# EAGLE design p1dc-001 (EAGLE 9.6.2)
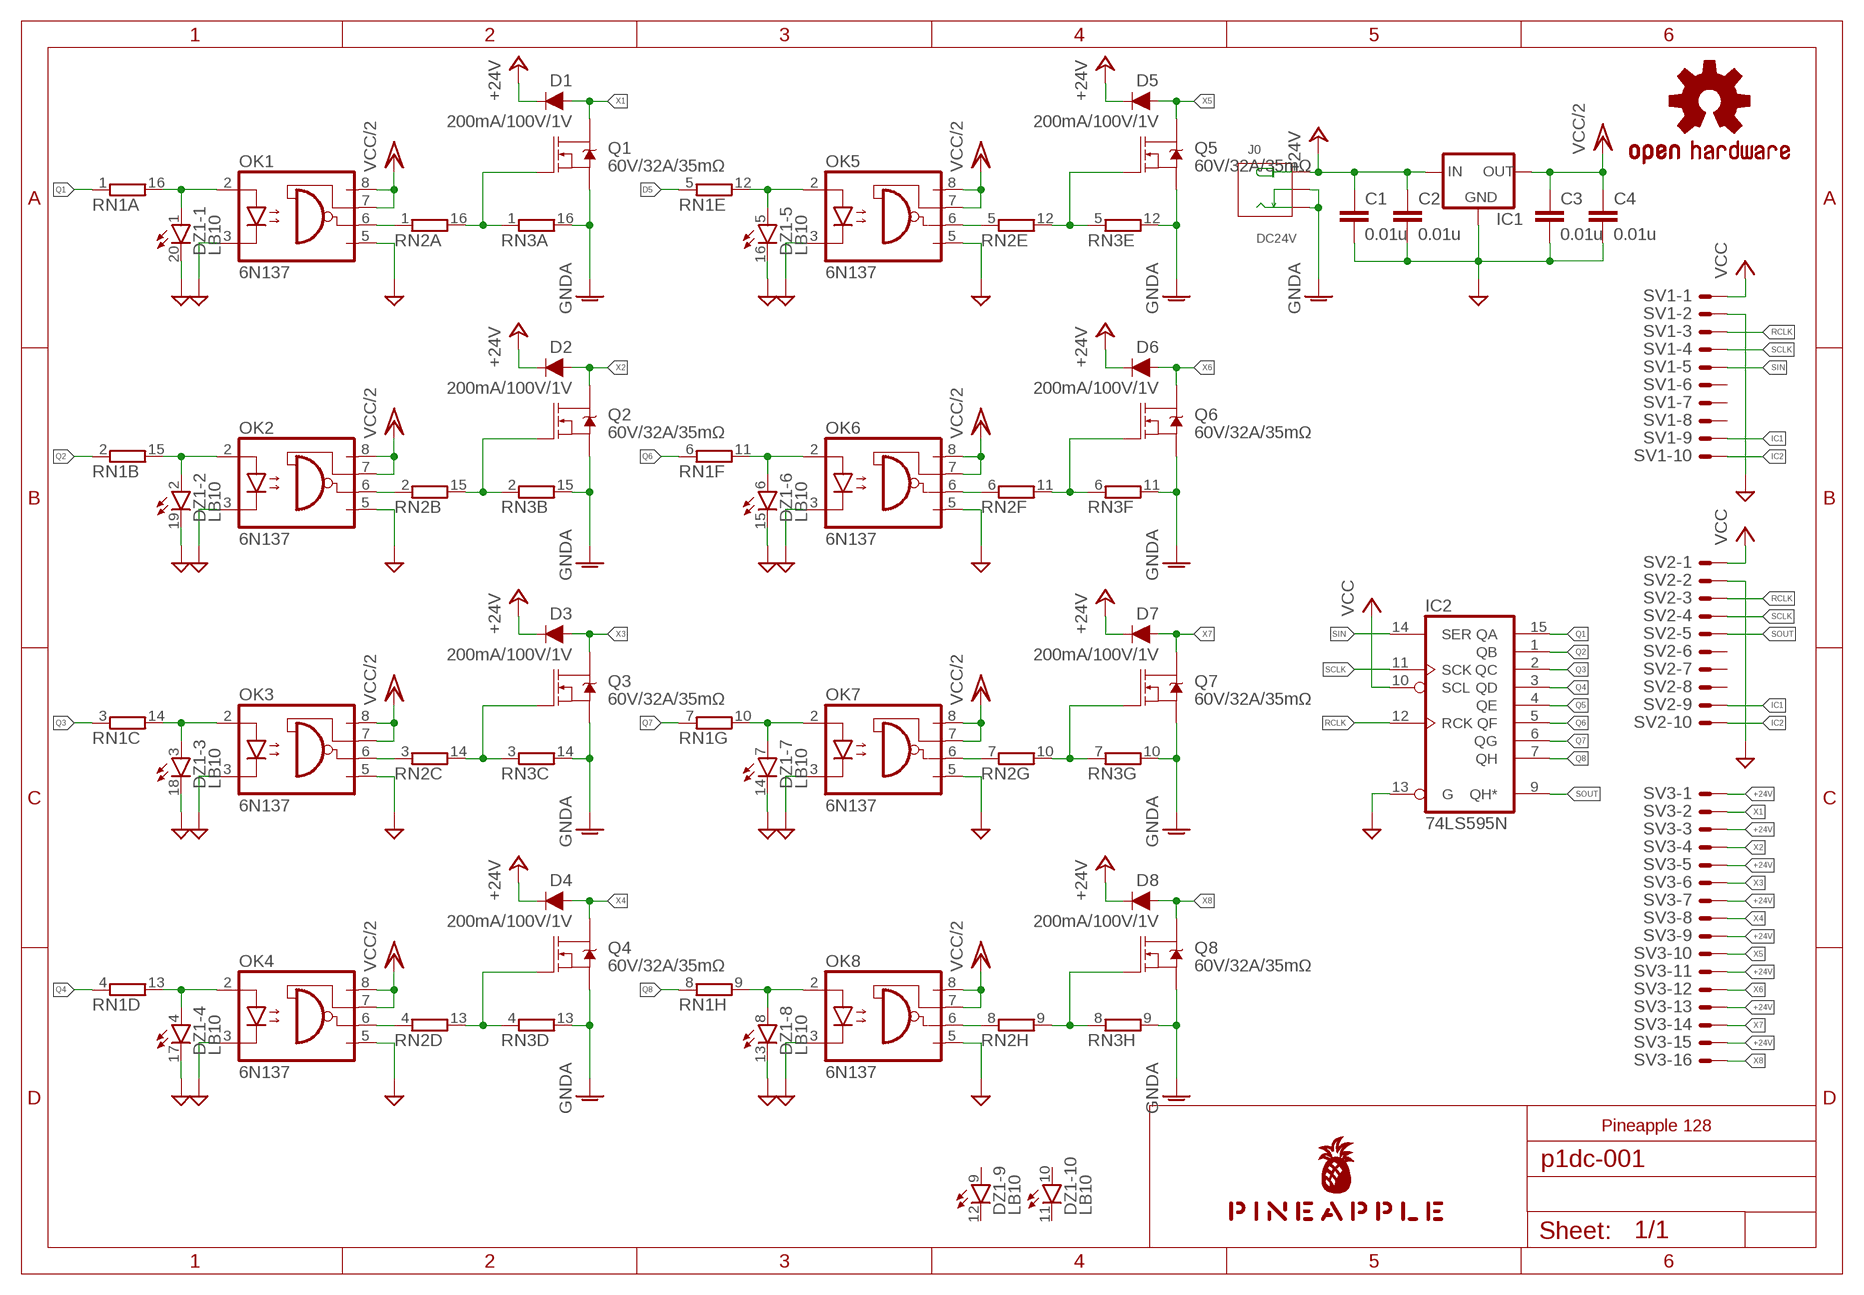
[diagram p0: schematic, sheet 1]

## Parts
C1  0.01u  C-EU025-024X044  [C025-024X044]
C2  0.01u  C-EU025-024X044  [C025-024X044]
C3  0.01u  C-EU025-024X044  [C025-024X044]
C4  0.01u  C-EU025-024X044  [C025-024X044]
D1  200mA/100V/1V  DIODE-1N4148  [DIODE-1N4148]
D2  200mA/100V/1V  DIODE-1N4148  [DIODE-1N4148]
D3  200mA/100V/1V  DIODE-1N4148  [DIODE-1N4148]
D4  200mA/100V/1V  DIODE-1N4148  [DIODE-1N4148]
D5  200mA/100V/1V  DIODE-1N4148  [DIODE-1N4148]
D6  200mA/100V/1V  DIODE-1N4148  [DIODE-1N4148]
D7  200mA/100V/1V  DIODE-1N4148  [DIODE-1N4148]
D8  200mA/100V/1V  DIODE-1N4148  [DIODE-1N4148]
DZ1  LB10  [LB10]
IC1  78XXS  [78XXS]
IC2  74LS595N  [DIL16]
J0  DC24V  JACK-DC-005'DC-005'  [3P-L14.2*W11.0*H9.0MM]
LOGO1  OSHW-LOGOS-COPPER  [OSHW-LOGO-S_COPPER]
OK1  6N137  [DIL08]
OK2  6N137  [DIL08]
OK3  6N137  [DIL08]
OK4  6N137  [DIL08]
OK5  6N137  [DIL08]
OK6  6N137  [DIL08]
OK7  6N137  [DIL08]
OK8  6N137  [DIL08]
Q1  60V/32A/35mΩ  MOSFET-NCH-FQP30N06L  [TO220V]
Q2  60V/32A/35mΩ  MOSFET-NCH-FQP30N06L  [TO220V]
Q3  60V/32A/35mΩ  MOSFET-NCH-FQP30N06L  [TO220V]
Q4  60V/32A/35mΩ  MOSFET-NCH-FQP30N06L  [TO220V]
Q5  60V/32A/35mΩ  MOSFET-NCH-FQP30N06L  [TO220V]
Q6  60V/32A/35mΩ  MOSFET-NCH-FQP30N06L  [TO220V]
Q7  60V/32A/35mΩ  MOSFET-NCH-FQP30N06L  [TO220V]
Q8  60V/32A/35mΩ  MOSFET-NCH-FQP30N06L  [TO220V]
RN1  8R-N  [DIL16]
RN2  8R-N  [DIL16]
RN3  8R-N  [DIL16]
SV1  ML10LE  [ML10L]
SV2  ML10LE  [ML10L]
SV3  ML16LE  [ML16L]
U$1  PINEAPPLE450_SILK  [PINEAPPLE450_SILK]

## Nets
+24V [power]: C1.1 C2.1 D1.C D2.C D3.C D4.C D5.C D6.C D7.C D8.C IC1.IN J0.+ SV3.1 SV3.3 SV3.5 SV3.7 SV3.9 SV3.11 SV3.13 SV3.15
D5: RN1.5
GND [gnd]: C1.2 C2.2 C3.2 C4.2 DZ1.13(-8:C) DZ1.14(-7:C) DZ1.15(-6:C) DZ1.16(-5:C) DZ1.17(-4:C) DZ1.18(-3:C) DZ1.19(-2:C) DZ1.20(-1:C) IC1.GND IC2.13(G) OK1.3(C) OK1.5(GND) OK2.3(C) OK2.5(GND) OK3.3(C) OK3.5(GND) OK4.3(C) OK4.5(GND) OK5.3(C) OK5.5(GND) OK6.3(C) OK6.5(GND) OK7.3(C) OK7.5(GND) OK8.3(C) OK8.5(GND) SV1.2 SV2.2
GNDA [gnd]: J0.-1(-) J0.-2(CDN) Q1.3(S) Q2.3(S) Q3.3(S) Q4.3(S) Q5.3(S) Q6.3(S) Q7.3(S) Q8.3(S) RN3.9 RN3.10 RN3.11 RN3.12 RN3.13 RN3.14 RN3.15 RN3.16
IC1: SV1.9 SV2.9
IC2: SV1.10 SV2.10
N$1: DZ1.1(-1:A) OK1.2(A) RN1.16
N$2: OK1.6(VO) RN2.1
N$3: Q1.1(G) RN2.16 RN3.1
N$4: DZ1.2(-2:A) OK2.2(A) RN1.15
N$5: OK2.6(VO) RN2.2
N$6: Q2.1(G) RN2.15 RN3.2
N$7: DZ1.3(-3:A) OK3.2(A) RN1.14
N$8: OK3.6(VO) RN2.3
N$9: Q3.1(G) RN2.14 RN3.3
N$10: DZ1.4(-4:A) OK4.2(A) RN1.13
N$11: OK4.6(VO) RN2.4
N$12: Q4.1(G) RN2.13 RN3.4
N$13: DZ1.5(-5:A) OK5.2(A) RN1.12
N$14: OK5.6(VO) RN2.5
N$15: Q5.1(G) RN2.12 RN3.5
N$16: DZ1.6(-6:A) OK6.2(A) RN1.11
N$17: OK6.6(VO) RN2.6
N$18: Q6.1(G) RN2.11 RN3.6
N$19: DZ1.7(-7:A) OK7.2(A) RN1.10
N$20: OK7.6(VO) RN2.7
N$21: Q7.1(G) RN2.10 RN3.7
N$22: DZ1.8(-8:A) OK8.2(A) RN1.9
N$23: OK8.6(VO) RN2.8
N$24: Q8.1(G) RN2.9 RN3.8
Q1: IC2.15(QA) RN1.1
Q2: IC2.1(QB) RN1.2
Q3: IC2.2(QC) RN1.3
Q4: IC2.3(QD) RN1.4
Q5: IC2.4(QE)
Q6: IC2.5(QF) RN1.6
Q7: IC2.6(QG) RN1.7
Q8: IC2.7(QH) RN1.8
RCLK: IC2.12(RCK) SV1.3 SV2.3
SCLK: IC2.11(SCK) SV1.4 SV2.4
SIN: IC2.14(SER) SV1.5
SOUT: IC2.9(QH*) SV2.5
VCC: IC2.10(SCL) SV1.1 SV2.1
VCC/2 [power]: C3.1 C4.1 IC1.OUT OK1.7(VE) OK1.8(VCC) OK2.7(VE) OK2.8(VCC) OK3.7(VE) OK3.8(VCC) OK4.7(VE) OK4.8(VCC) OK5.7(VE) OK5.8(VCC) OK6.7(VE) OK6.8(VCC) OK7.7(VE) OK7.8(VCC) OK8.7(VE) OK8.8(VCC)
X1: D1.A Q1.2(D) SV3.2
X2: D2.A Q2.2(D) SV3.4
X3: D3.A Q3.2(D) SV3.6
X4: D4.A Q4.2(D) SV3.8
X5: D5.A Q5.2(D) SV3.10
X6: D6.A Q6.2(D) SV3.12
X7: D7.A Q7.2(D) SV3.14
X8: D8.A Q8.2(D) SV3.16
Unconnected: DZ1.9(-9:A) DZ1.10(-10:A) DZ1.11(-10:C) DZ1.12(-9:C) SV1.6 SV1.7 SV1.8 SV2.6 SV2.7 SV2.8

## Notes on the sheet
- Pineapple 128

## Power pins joined to a net without a drawn wire
GND: IC2.8(GND)
VCC: IC2.16(VCC)

## Library data of the parts
C1-C4 = resistor:C-EU: CAPACITOR, European symbol
D1-D8 = SparkFun-DiscreteSemi:DIODE: Diode These are standard reverse protection diodes and small signal diodes. SparkFun Products: SparkFun SparkPunk Sound Kit <https://www.sparkfun.com/products/11177> SparkFun ESP8266 Thing <https://www.sparkfun.com/products/13231>; PROD_ID: DIO-08378
DZ1 = led:LB10: LED BLOCK 10-LED bar graph, DIL, Siemens
IC1 = v-reg:78XXS: VOLTAGE REGULATOR
IC2 = 74xx-us:74*595: 8-bit SHIFT REGISTER, output latch
J0 = Seeed-Connector:JACK-DC-005: 320120003
LOGO1 = SparkFun-Aesthetics:OSHW-LOGO: Open-Source Hardware (OSHW) Logo This logo indicates the piece of hardware it is found on incorporates a OSHW license and/or adheres to the definition of open source hardware found here: http://freedomdefined.org/OSHW
OK1-OK8 = optocoupler:6N137: MOTOROLA OPTO COUPLER; MPN: 6N137; OC_FARNELL: 1328376; OC_NEWARK: 52M1895
Q1-Q8 = SparkFun-DiscreteSemi:MOSFET-NCH: N-channel MOSFETs Voltage controlled devices that allow control of high current outputs. SparkFun Products: SparkFun OpenScale <https://www.sparkfun.com/products/13261> SparkFun Digital Sandbox <https://www.sparkfun.com/products/12651> SparkFun Monster Moto Shield <https://www.sparkfun.com/products/10182> SparkFun MOSFET Power Controller <https://www.sparkfun.com/products/11214>; PROD_ID: TRANS-10060
RN1-RN3 = resistor-dil:8R-N: DIL RESISTOR; OC_FARNELL: unknown; OC_NEWARK: unknown
SV1 SV2 = con-ml:ML10LE: HARTING; OC_FARNELL: unknown; OC_NEWARK: unknown
SV3 = con-ml:ML16LE: HARTING; OC_FARNELL: unknown; OC_NEWARK: unknown
U$1 = pineapple:PINEAPPLE450_SILK

## Net classes
0 default: width 0.152 mm, drill 0.152 mm, clearance 0.152 mm
1 gnd: width 0.61 mm, drill 0.152 mm, clearance 0.152 mm
2 power: width 0.61 mm, drill 0.152 mm, clearance 0.152 mm
3 analog: width 0.152 mm, drill 0.152 mm, clearance 0.152 mm

## Board
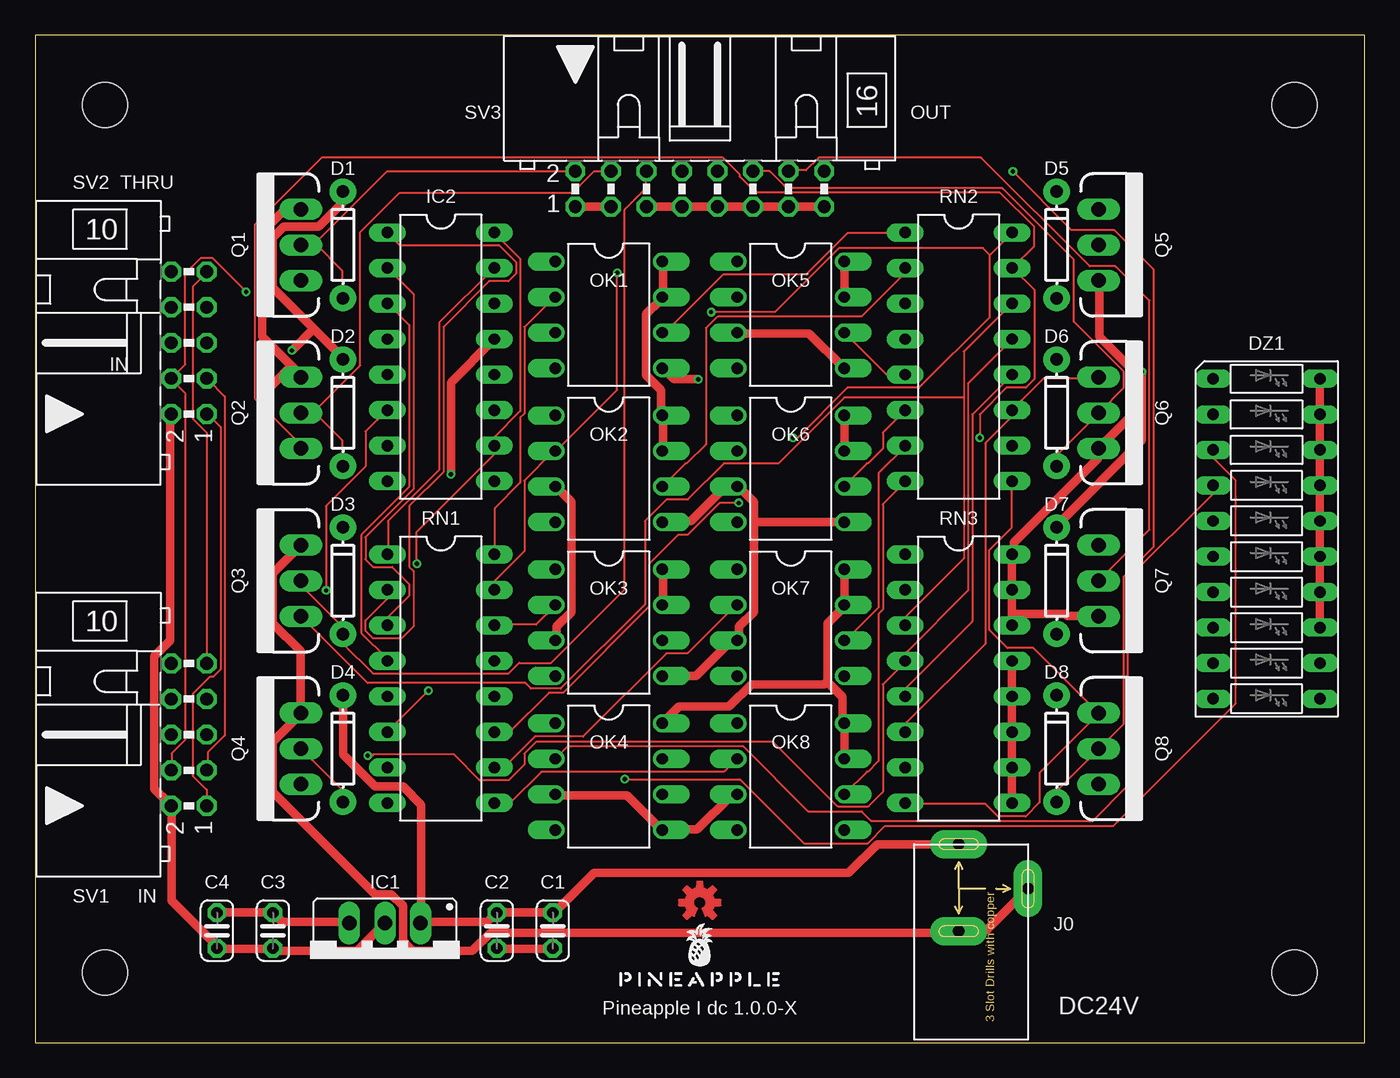
[diagram p1: board, top side]
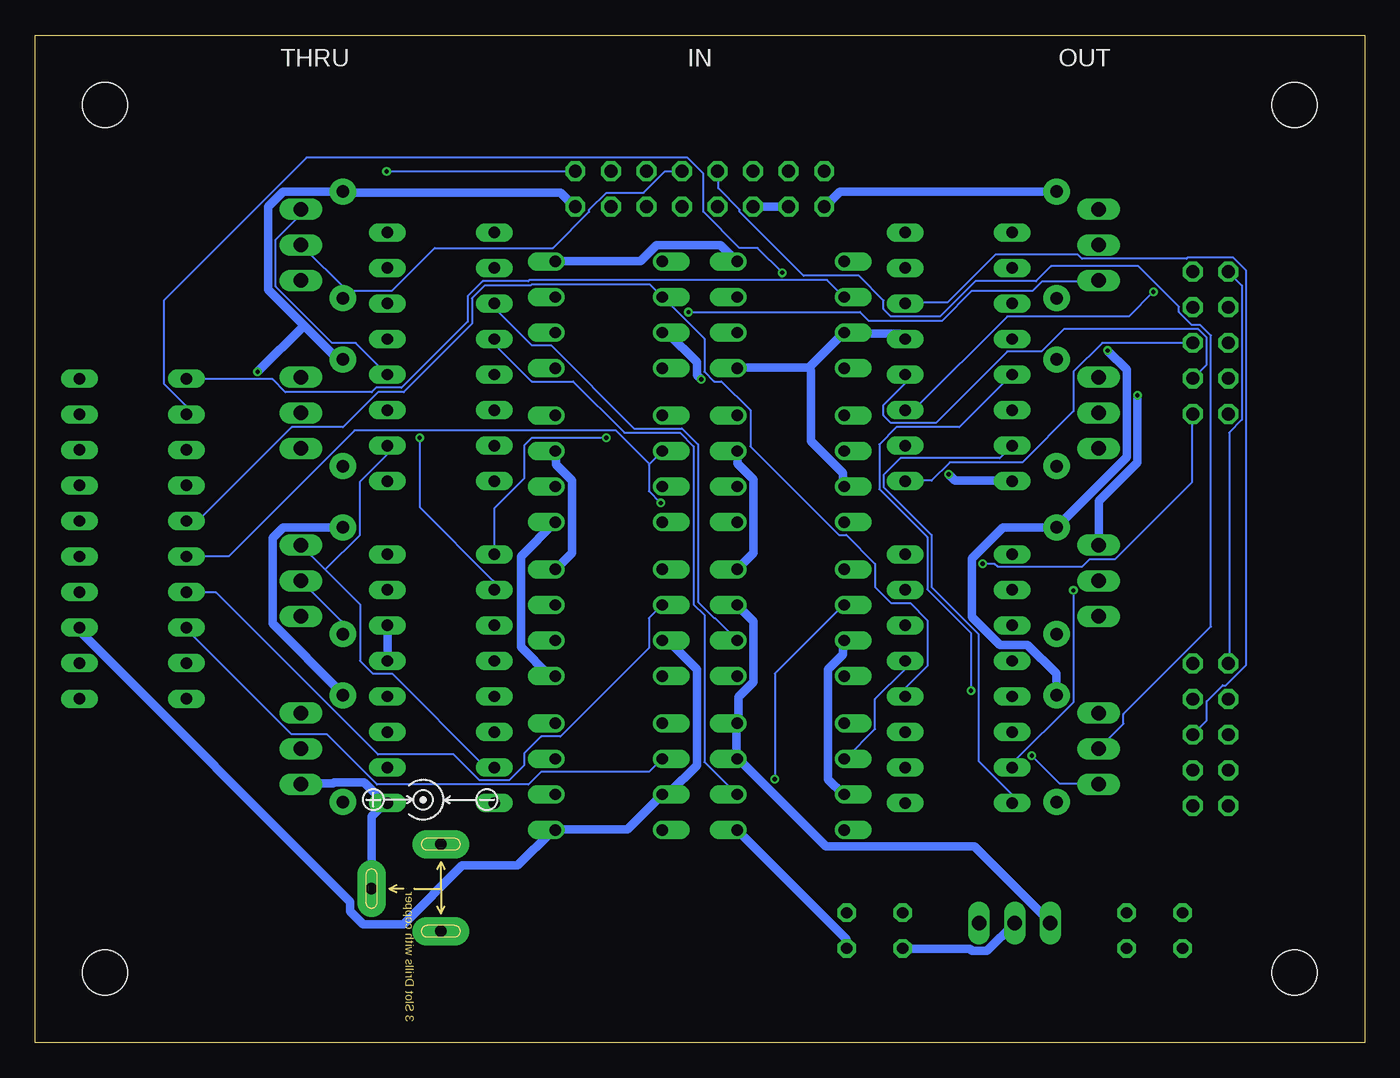
[diagram p2: board, bottom side, seen from below]

Size 95 x 72 mm. Coordinates in mm from the lower left corner, seen from the top.
Outline: 0,0 95,0 95,72 0,72 0,0
Copper layers (1*16): Top 0.035mm / dielectric 1.5mm / Bottom 0.035mm
Design rules "SeeedStudio_2layer_DRU_no_angle_20140221": minimum track width 6mil, minimum drill 12mil, track to track 6mil, track to pad 6mil, pad to pad 6mil, via to via 6mil, smd to smd 0mil, copper to edge 10mil, drill to drill 10mil, minimum pad ring 10mil, minimum via ring 6mil, stop-mask expansion 2mil, vias tented up to drill 100mil, thermal gap 10mil
Holes 3.2 mm at 5,5 90,5 90,67 5,67
tRestrict: area 2.8,64.8 to 7.2,69.2; area 87.8,64.8 to 92.2,69.2; area 2.8,2.8 to 7.2,7.2; area 87.8,2.8 to 92.2,7.2; area 0,71 to 95,72; area 94,0 to 95,72; area 0,0 to 95,1; area 0,0 to 1,72
bRestrict: area 2.8,2.8 to 7.2,7.2; area 87.8,2.8 to 92.2,7.2; area 87.8,64.8 to 92.2,69.2; area 2.8,64.8 to 7.2,69.2; area 0,71 to 95,72; area 94,0 to 95,72; area 0,0 to 95,1; area 0,0 to 1,72

### Footprints (pad centres in the part's own frame; a part is rotated, then mirrored left to right if it is on the bottom)
C025-024X044 = drill 0.813 octagon: 1 -1.27,0; 2 1.27,0
DIODE-1N4148 = drill 0.9 pad 1.88: A -3.81,0; C 3.81,0
LB10 = drill 0.813 long: 1 -11.43,-3.81; 2 -8.89,-3.81; 3 -6.35,-3.81; 4 -3.81,-3.81; 5 -1.27,-3.81; 6 1.27,-3.81; 7 3.81,-3.81; 8 6.35,-3.81; 9 8.89,-3.81; 10 11.43,-3.81; 11 11.43,3.81; 12 8.89,3.81; 13 6.35,3.81; 14 3.81,3.81; 15 1.27,3.81; 16 -1.27,3.81; 17 -3.81,3.81; 18 -6.35,3.81; 19 -8.89,3.81; 20 -11.43,3.81
78XXS = drill 1.016 long: GND 0,-2.54; IN -2.54,-2.54; OUT 2.54,-2.54
DIL16 = drill 0.813 long: 1 -8.89,-3.81; 2 -6.35,-3.81; 3 -3.81,-3.81; 4 -1.27,-3.81; 5 1.27,-3.81; 6 3.81,-3.81; 7 6.35,-3.81; 8 8.89,-3.81; 9 8.89,3.81; 10 6.35,3.81; 11 3.81,3.81; 12 1.27,3.81; 13 -1.27,3.81; 14 -3.81,3.81; 15 -6.35,3.81; 16 -8.89,3.81
3P-L14.2*W11.0*H9.0MM = drill 0.813 pad 2.032 long: + 3.175,0; -1 -3.048,0; -2 0,-4.953
DIL08 = drill 0.813 offset: 1 -3.81,-3.81; 2 -1.27,-3.81; 3 1.27,-3.81; 4 3.81,-3.81; 5 3.81,3.81; 6 1.27,3.81; 7 -1.27,3.81; 8 -3.81,3.81
TO220V = drill 1.016 long: 1 -2.54,0; 2 0,0; 3 2.54,0
ML10L = drill 0.914 octagon: 1 -5.08,-1.27; 2 -5.08,1.27; 3 -2.54,-1.27; 4 -2.54,1.27; 5 0,-1.27; 6 0,1.27; 7 2.54,-1.27; 8 2.54,1.27; 9 5.08,-1.27; 10 5.08,1.27
ML16L = drill 0.914 octagon: 1 -8.89,-1.27; 2 -8.89,1.27; 3 -6.35,-1.27; 4 -6.35,1.27; 5 -3.81,-1.27; 6 -3.81,1.27; 7 -1.27,-1.27; 8 -1.27,1.27; 9 1.27,-1.27; 10 1.27,1.27; 11 3.81,-1.27; 12 3.81,1.27; 13 6.35,-1.27; 14 6.35,1.27; 15 8.89,-1.27; 16 8.89,1.27

### Placement (x,y rotation side)
C1  37,8 270 top
C2  33,8 270 top
C3  17,8 270 top
C4  13,8 270 top
D1  22,57 90 top
D2  22,45 90 top
D3  22,33 90 top
D4  22,21 90 top
D5  73,57 90 top
D6  73,45 90 top
D7  73,33 90 top
D8  73,21 90 top
DZ1  88,36 270 top
IC1  25,6 180 top
IC2  29,49 270 top
J0  66,11 90 top
LOGO1  47.5,10 0 top
OK1  41,52 270 top
OK2  41,41 270 top
OK3  41,30 270 top
OK4  41,19 270 top
OK5  54,52 270 top
OK6  54,41 270 top
OK7  54,30 270 top
OK8  54,19 270 top
Q1  19,57 90 top
Q2  19,45 90 top
Q3  19,33 90 top
Q4  19,21 90 top
Q5  76,57 270 top
Q6  76,45 270 top
Q7  76,33 270 top
Q8  76,21 270 top
RN1  29,26 270 top
RN2  66,49 270 top
RN3  66,26 270 top
SV1  11,22 90 top
SV2  11,50 90 top
SV3  47.5,61 0 top
U$1  47.5,4 0 top

### Tracks (layer width: path | path; a pad name or v marks a point on that pad's centre or on a via)
+24V  (via drill 0.3)
  Top 0.61: D4.C 22.02,24.77 22.02,20.57 24.31,18.29 26.29,18.29 27.58,16.99 27.58,8.91 IC1.IN 27.58,8.61 32.31,8.61 32.77,9.07 C2.1 33.07,9.3 36.96,9.3 C1.1 37.26,9.45 39.93,12.12 58.14,12.12 60.2,14.17 J0.+ | v79.1,47.93 79.1,43.05 73.08,37.03 73.08,36.88 D7.C | 19.93,51.02 16.99,53.95 16.99,57.53 17.75,58.29 20.27,58.29 21.95,59.97 21.95,60.81 D1.C | 19.93,51.02 21.95,49 21.95,48.84 D2.C | SV3.1 38.63,59.74 SV3.3 | SV3.5 43.74,59.74 46.18,59.74 SV3.7 46.48,59.74 SV3.9 49.07,59.74 51.28,59.74 SV3.11 51.59,59.74 53.8,59.74 SV3.13 54.1,59.74 SV3.15 | 19.93,51.02 v18.36,49.45
  Bottom 0.61: D4.C 22.02,24.84 22.02,26.36 24.08,28.42 26.06,28.42 28.04,30.4 28.04,34.59 25.83,36.8 22.02,36.8 D3.C 21.79,37.03 16.99,41.83 16.99,48.08 v18.36,49.45 | D8.C 73.08,24.84 73.08,24.99 78.03,29.95 78.03,36.04 77.27,36.8 73.08,36.8 D7.C | 75.78,51.24 78.33,53.8 78.33,59.74 77.27,60.81 73.08,60.81 D5.C 72.69,60.73 57.45,60.73 56.46,59.74 SV3.15 | 75.78,51.24 73.38,48.84 73.08,48.84 D6.C | 75.78,51.24 v79.1,47.93 | SV3.3 41.22,59.74 43.66,59.74 SV3.5 | D1.C 22.02,60.81 37.49,60.81 38.56,59.74 SV3.1
GND  (via drill 0.3)
  Top 0.61: C2.2 33.07,6.71 36.96,6.71 C1.2 | SV2.2 9.68,44.88 9.68,28.73 8.53,27.58 8.53,18.14 9.53,17.14 SV1.2 9.75,16.92 9.75,10.13 12.88,7.01 C4.2 13.03,6.71 16.99,6.71 C3.2 17.22,6.55 23.01,6.55 IC1.GND | OK3.3 37.26,28.8 37.26,29.72 38.33,30.79 38.33,38.63 37.26,39.7 OK2.3 | OK5.3 50.22,50.67 55.32,50.67 57.76,48.23 OK5.5 | v29.72,40.62 29.72,47.17 32.77,50.22 IC2.13 | v47.4,47.4 45.64,47.4 44.88,48.16 OK1.5 | OK3.5 44.88,26.21 47.24,26.21 49.76,28.73 50.14,28.73 OK7.3 50.29,29.03 50.29,29.72 51.36,30.79 51.36,37.19 | OK2.5 44.88,37.26 46.86,37.26 49.3,39.7 50.14,39.7 OK6.3 50.44,39.55 51.36,38.63 51.36,37.19 | 51.36,37.19 57.76,37.19 OK6.5 | DZ1.13 91.82,29.72 91.82,32.16 DZ1.14 91.82,32.46 91.82,34.67 DZ1.15 91.82,34.98 DZ1.16 91.82,37.57 91.82,39.78 DZ1.17 91.82,40.08 91.82,42.29 DZ1.18 91.82,42.6 DZ1.19 91.82,45.19 91.82,47.4 DZ1.20 | OK8.3 50.14,17.68 49.76,17.68 47.32,15.24 44.88,15.24 OK4.5 44.58,15.39 42.29,17.68 37.26,17.68 OK4.3
  Bottom 0.61: C2.2 32.99,6.71 28.19,6.71 28.04,6.55 26.98,6.55 IC1.GND | v29.72,40.62 29.26,40.16 25.22,40.16 IC2.8 | IC2.13 32.84,50.29 33.22,50.67 37.19,50.67 OK1.3 37.41,50.52 39.7,48.23 | 39.7,48.23 44.81,48.23 OK1.5 | v47.4,47.4 47.7,47.7 47.7,48.62 49.76,50.67 50.14,50.67 OK5.3 | OK2.3 37.26,39.78 37.26,40.69 39.55,42.98 39.55,48.01 39.7,48.23 | OK7.5 57.84,26.21 58.22,26.21 60.27,28.27 60.27,34.75 57.84,37.19 OK6.5 | DZ1.13 91.75,29.64 91.75,29.34 72.47,10.06 72.47,9.37 71.55,8.46 68.66,8.46 64.47,12.65 60.5,12.65 58.06,15.09 OK8.5 57.76,15.24 52.65,15.24 50.22,17.68 OK8.3 49.91,17.83 49.68,17.83 47.7,19.81 47.7,26.67 49.76,28.73 50.14,28.73 OK7.3 | OK3.3 37.26,28.73 37.26,27.74 38.33,26.67 38.33,18.82 37.26,17.75 OK4.3 | C1.2 37.03,6.78 37.03,7.39 44.81,15.16 OK4.5
GNDA  (via drill 0.3)
  Top 0.61: Q3.3 18.97,35.51 16.99,33.53 16.99,29.95 18.97,27.96 18.97,23.55 Q4.3 18.82,23.32 16.99,21.49 16.99,17.91 24.31,10.59 25.45,10.59 26.29,9.75 26.29,7.24 26.98,6.55 31.24,6.55 32.54,7.85 65.76,7.85 J0.-1 66.06,8 67.97,8 70.94,10.97 J0.-2 | Q1.3 18.97,59.51 17.83,59.51 16.23,57.91 16.23,50.44 18.97,47.7 18.97,47.55 Q2.3 18.14,48.16 v16.23,46.25 | RN3.9 69.8,17.14 69.8,19.58 RN3.10 69.8,19.89 69.8,22.17 RN3.11 69.8,22.48 69.8,24.69 RN3.12 69.8,24.99 69.8,27.2 RN3.13 | 69.8,30.63 69.8,32.31 RN3.15 69.8,32.61 69.8,34.82 RN3.16 69.95,35.13 69.95,35.74 75.97,41.76 75.97,42.44 Q6.3 76.2,42.67 78.33,44.81 78.33,48.16 76.05,50.44 76.05,54.41 Q5.3 | 69.8,30.63 69.8,29.87 RN3.14 | 69.8,30.63 73.61,30.63 73.76,30.48 75.97,30.48 Q7.3
  Bottom 0.61: v16.23,46.25 16.23,41.45 18.97,38.71 18.97,35.59 Q3.3 | Q8.3 75.97,18.52 73.69,18.52 73.61,18.59 71.48,18.59 70.03,17.14 69.88,17.14 RN3.9 70.18,16.92 70.94,16.15 70.94,11.05 J0.-2 | RN3.13 69.8,29.79 RN3.14
IC1
  Top 0.152: SV1.9 12.27,27.13 12.27,43.59 11.28,44.58 11.28,54.03 12.27,55.02 SV2.9
IC2
  Bottom 0.152: SV1.10 9.68,27.13 9.68,43.59 8.76,44.5 8.76,54.1 9.68,55.02 SV2.10
N$1
  Top 0.152: RN1.16 32.84,34.9 32.84,38.18 34.67,40.01 34.67,44.65 34.98,44.96 34.98,51.13 37.19,53.34 OK1.2
  Bottom 0.152: DZ1.1 84.12,47.4 78.03,47.4 77.11,46.48 70.94,46.48 70.64,46.79 68.81,46.79 64.08,51.51 64.08,53.34 63.02,54.41 59.74,54.41 59.66,54.48 38.41,54.48 37.26,53.34 OK1.2
N$2
  Top 0.152: OK1.6 44.88,50.75 45.03,50.75 49.15,54.86 55.09,54.86 58.06,57.84 62.18,57.84 RN2.1
N$3  (via drill 0.3)
  Top 0.152: v54.18,43.2 54.48,43.2 58.06,46.79 63.17,46.79 68.2,51.82 68.2,56.24 68.24,56.27 | 68.24,56.27 69.8,57.84 RN2.16 | v48.31,52.2 52.88,52.2 57.45,56.77 67.74,56.77 68.24,56.27
  Bottom 0.152: v54.18,43.2 59.51,43.2 60.05,42.67 60.05,40.31 62.18,38.18 RN3.1 | v48.31,52.2 36.04,52.2 35.43,51.59 30.18,51.59 28.04,53.72 23.7,53.72 23.01,54.41 19.05,54.41 Q1.1
N$4  (via drill 0.3)
  Top 0.152: RN1.15 32.84,32.38 32.84,32.99 34.98,35.13 34.98,40.16 37.03,42.22 37.19,42.22 OK2.2 37.26,42.29 41.6,46.63 v41.6,55.02
  Bottom 0.152: v41.6,55.02 43.36,56.77 44.65,56.77 47.24,59.36 47.24,62.1 48.39,63.25 75.59,63.25 85.8,53.03 85.8,47.09 84.2,45.49 84.2,44.96 DZ1.2
N$5
  Top 0.152: OK2.6 44.88,39.78 46.48,41.38 46.56,41.38 47.93,42.75 47.93,51.05 48.77,51.89 59.05,51.89 62.18,55.02 62.18,55.32 RN2.2
N$6  (via drill 0.3)
  Top 0.152: v67.51,43.2 67.51,44.88 69.42,46.79 70.79,46.79 71.4,47.4 71.4,53.8 69.88,55.32 RN2.15 69.88,55.4 71.4,56.92 71.4,58.29 68.96,60.73 51.51,60.73 50.37,61.87 50.37,62.03 49.15,63.25 20.5,63.25 15.7,58.45 15.7,46.02 18.97,42.75 18.97,42.52 Q2.1
  Bottom 0.152: v67.51,43.2 67.51,38.25 62.26,32.99 62.26,32.38 RN3.2
N$7  (via drill 0.3)
  Top 0.152: RN1.14 32.84,29.87 35.81,29.87 37.19,31.24 OK3.2 | v42.14,18.82 50.37,18.82 54.94,14.25 59.51,14.25 60.73,15.47 77.04,15.47 85.8,24.23 85.8,40.16 84.2,41.76 84.2,42.29 DZ1.3
  Bottom 0.152: v42.14,18.82 42.14,26.36 37.26,31.24 OK3.2
N$8
  Bottom 0.152: OK3.6 44.88,28.8 46.41,30.33 46.48,30.33 47.62,31.47 47.62,42.75 48.77,43.89 52.2,43.89 58.14,49.84 59.51,49.84 62.18,52.5 RN2.3
N$9
  Top 0.152: 66.37,46.1 66.37,49.38 RN2.14 | 66.37,46.1 66.37,34.59 62.26,30.48 62.26,29.87 RN3.3 | 66.37,46.1 57.84,46.1 53.11,41.38 49.23,41.38 46.63,38.79 45.11,38.79 43.59,37.26 43.59,31.32 37.57,25.3 35.43,25.3 35.05,25.68 23.77,25.68 19.05,30.4 Q3.1
N$10
  Top 0.152: DZ1.4 84.12,39.78 84.12,39.17 78.11,33.15 78.11,18.36 75.59,15.85 59.74,15.85 59.05,16.54 55.24,16.54 50.6,21.18 38.1,21.18 37.26,20.34 OK4.2
  Bottom 0.152: RN1.13 32.84,27.2 32.84,26.67 34.98,24.54 34.98,22.4 37.03,20.34 37.19,20.34 OK4.2
N$11
  Bottom 0.152: OK4.6 44.88,17.75 47.17,20.04 47.17,30.56 47.93,31.32 47.93,42.6 48.92,43.59 52.88,43.59 56.54,47.24 59.51,47.24 62.18,49.91 62.18,50.22 RN2.4
N$12  (via drill 0.3)
  Top 0.152: RN2.13 69.8,50.22 66.67,47.09 66.67,32.31 62.26,27.89 62.26,27.28 RN3.4 62.18,27.2 60.58,25.6 60.58,17.91 59.51,16.84 57.38,16.84 52.73,21.49 35.81,21.49 34.98,20.65 34.98,19.89 33.83,18.75 31.77,18.75 29.95,20.57 24.16,20.57 24.08,20.5 v23.77,20.5
  Bottom 0.152: v23.77,20.5 21.79,18.52 19.05,18.52 Q4.1
N$13
  Bottom 0.152: RN1.12 32.77,24.77 32.77,25.38 31.24,26.9 31.24,30.18 32.46,31.39 33.83,31.39 34.98,32.54 34.98,34.21 37.03,36.27 37.57,36.27 43.89,42.6 43.89,45.19 45.95,47.24 46.48,47.24 47.17,47.93 47.17,50.29 50.14,53.26 OK5.2 50.22,53.34 51.05,54.18 59.51,54.18 59.59,54.1 62.87,54.1 63.78,53.19 63.78,51.36 68.66,46.48 70.48,46.48 73,43.97 76.66,43.97 83.29,37.34 84.12,37.34 DZ1.5
N$14
  Top 0.152: RN2.5 62.18,47.78 60.81,47.78 57.84,50.75 OK5.6
N$15
  Top 0.152: RN3.5 62.26,24.77 62.26,25.38 66.98,30.1 66.98,44.88 69.8,47.7 RN2.12
  Bottom 0.152: Q5.1 76.05,59.51 76.05,59.13 77.8,57.38 77.8,54.03 73.76,49.99 72.08,49.99 69.88,47.78 RN2.12
N$16  (via drill 0.3)
  Top 0.152: v50.29,38.56 48.92,38.56 46.63,36.27 45.95,36.27 43.89,34.21 43.89,31.17 37.72,24.99 36.73,24.99 33.98,22.25 32.84,22.25 RN1.11
  Bottom 0.152: v50.29,38.56 51.13,39.4 51.13,41.3 51.09,41.34 | 51.09,41.34 50.22,42.22 OK6.2 | 51.09,41.34 53.49,43.74 72.16,43.74 81.15,34.75 84.12,34.75 DZ1.6
N$17
  Top 0.152: OK6.6 57.84,39.78 59.44,41.38 59.51,41.38 60.58,42.44 60.58,43.59 RN2.6
N$18
  Top 0.152: RN3.6 62.26,22.25 62.26,22.86 67.89,28.5 67.89,42.82 69.8,44.73 RN2.11 69.88,45.26 72.08,47.47 75.97,47.47 Q6.1
N$19
  Top 0.152: RN1.10 32.84,19.66 33.53,19.66 35.74,21.87 39.17,21.87 45.11,27.81 46.63,27.81 50.14,31.32 OK7.2
  Bottom 0.152: DZ1.7 84.12,32.16 82.07,32.16 70.48,20.57 65.08,20.57 63.25,18.75 61.11,18.75 60.05,19.81 60.05,20.65 58.83,21.87 57.45,21.87 51.13,28.19 51.13,30.33 50.22,31.24 OK7.2
N$20
  Top 0.152: OK7.6 57.84,28.8 57.99,28.8 60.27,31.09 60.27,40.69 62.18,42.6 RN2.7
N$21
  Bottom 0.152: 74.26,33.8 75.97,35.51 Q7.1 | 74.26,33.8 71.78,31.32 71.78,27.28 70.87,26.36 69.49,26.36 62.79,19.66 62.26,19.66 RN3.7 | 74.26,33.8 71.78,36.27 71.78,40.08 69.88,41.99 69.88,42.6 RN2.10
N$22
  Top 0.152: RN1.9 32.84,17.14 33.98,17.14 36.2,19.36 49.23,19.36 50.14,20.27 OK8.2
  Bottom 0.152: DZ1.8 84.12,29.64 84.12,29.49 76.66,22.02 74.14,22.02 70.56,18.44 59.74,18.44 58.83,19.36 51.13,19.36 50.22,20.27 OK8.2
N$23
  Top 0.152: OK8.6 57.84,17.75 59.44,19.36 59.51,19.36 60.27,20.12 60.27,30.63 60.58,30.94 60.58,38.48 62.18,40.08 RN2.8
N$24
  Top 0.152: RN3.8 62.26,17.07 67.89,17.07 68.81,16.15 70.79,16.15 71.78,17.14 71.78,19.28 75.97,23.47 Q8.1 75.97,23.55 71.32,28.19 69.49,28.19 68.2,29.49 68.2,35.2 69.8,36.8 69.8,40.08 RN2.9
Q1
  Top 0.152: RN1.1 25.22,34.9 25.22,37.26 28.88,40.92 28.88,51.44 32.77,55.32 IC2.15
Q2
  Top 0.152: RN1.2 25.15,32.31 25.15,31.7 23.62,30.18 23.62,29.41 24.16,28.88 26.21,28.88 27.05,29.72 27.05,33.68 26.75,33.98 26.75,38.33 29.18,40.77 29.18,51.13 32.46,54.41 33.83,54.41 34.37,54.94 34.37,55.78 33.15,57 26.06,57 25.22,57.84 IC2.1
Q3
  Top 0.152: RN1.3 25.22,29.87 25.22,30.4 26.75,31.93 26.75,32.77 25.53,33.98 24.16,33.98 23.62,34.52 23.62,36.12 27.05,39.55 27.05,53.49 25.22,55.32 IC2.2
Q4
  Top 0.152: RN1.4 25.15,27.28 25.15,27.43 23.32,29.26 23.32,36.27 26.75,39.7 26.75,51.28 25.22,52.81 IC2.3
Q6  (via drill 0.3)
  Top 0.152: v28.12,25.15 25.22,22.25 RN1.6
  Bottom 0.152: v28.12,25.15 28.12,29.26 31.24,32.38 31.24,36.12 34.67,39.55 34.67,42.75 33.45,43.97 28.96,43.97 25.22,47.7 IC2.5
Q7  (via drill 0.3)
  Top 0.152: v20.8,32.31 20.8,38.33 23.62,41.15 23.62,43.66 25.15,45.19 IC2.6
  Bottom 0.152: v20.8,32.31 20.8,24.31 25.15,19.96 25.15,19.66 RN1.7
Q8
  Bottom 0.152: RN1.8 25.22,17.14 25.22,17.75 27.58,20.12 27.58,29.18 30.94,32.54 30.94,36.27 34.37,39.7 34.37,40.54 33.15,41.76 26.06,41.76 25.22,42.6 IC2.7
RCLK
  Top 0.152: SV1.3 12.34,19.51 12.34,20.73 13.56,21.95 13.56,46.18 12.34,47.4 SV2.3
  Bottom 0.152: IC2.12 32.84,47.7 32.84,47.09 34.37,45.57 34.37,44.81 33.83,44.27 30.63,44.27 25.53,49.38 23.09,49.38 21.49,50.98 11.89,50.98 11.28,50.37 11.28,48.46 12.27,47.47 SV2.3
SCLK  (via drill 0.3)
  Top 0.152: v15.09,53.65 12.65,56.08 11.89,56.08 10.74,54.94 10.74,48.46 9.75,47.47 SV2.4 9.75,47.4 10.74,46.41 10.74,21.64 9.75,20.65 9.75,19.51 SV1.4
  Bottom 0.152: v15.09,53.65 16.84,51.89 25.53,51.89 32.16,45.26 32.77,45.26 IC2.11
SIN
  Bottom 0.152: IC2.14 32.77,52.88 29.79,52.88 26.36,56.31 20.5,56.31 20.19,56.01 12.72,56.01 12.65,56.08 9.37,56.08 8.46,55.17 8.46,26.98 9.91,25.53 10.13,25.53 11.28,24.38 11.28,23.01 12.27,22.02 SV1.5
SOUT
  Bottom 0.152: IC2.9 32.77,40.16 30.94,40.16 29.64,41.45 24.46,41.45 20.8,45.11 20.8,47.93 18.75,49.99 12.34,49.99 SV2.5
VCC  (via drill 0.3)
  Top 0.152: IC2.16 32.84,57.84 34.67,56.01 34.67,45.11 32.84,43.28 32.84,42.67 IC2.10 32.77,42.6 32.77,41.99 27.28,36.5 v27.28,34.21 | SV1.1 12.27,16.99 12.27,18.06 11.28,19.05 11.28,24.92 12.5,26.14 12.72,26.14 13.26,26.67 13.26,43.97 12.34,44.88 SV2.1
  Bottom 0.152: v27.28,34.21 26.44,34.21 26.21,33.98 20.19,33.98 19.66,34.52 17.83,34.52 12.34,40.01 12.34,44.88 SV2.1
VCC/2
  Top 0.61: OK5.7 57.84,53.34 57.84,55.78 OK5.8 | OK2.7 44.88,42.29 44.88,44.81 OK2.8 44.73,45.11 44.73,46.63 43.66,47.7 43.66,52.05 44.65,53.03 OK1.7 44.88,53.34 44.88,55.78 OK1.8 | OK6.7 57.84,42.29 57.84,44.81 OK6.8 | OK8.7 57.84,20.34 57.84,22.78 OK8.8 57.68,23.09 57.68,24.69 56.62,25.76 | OK7.8 57.84,33.76 57.84,31.32 OK7.7 57.68,31.01 56.62,29.95 56.62,25.76 | C4.1 13.03,9.3 16.99,9.3 C3.1 17.22,9.07 17.68,8.61 22.4,8.61 IC1.OUT | OK3.7 44.88,31.32 44.88,33.76 OK3.8 | 56.62,25.76 56.39,25.6 51.21,25.6 49.61,24 46.02,24 44.88,22.86 OK4.8
  Bottom 0.61: OK5.8 57.76,55.85 51.74,55.85 50.6,57 46.02,57 44.88,55.85 OK1.8 | OK6.7 57.76,42.22 57.76,41.3 56.62,40.16 56.62,34.98 57.76,33.83 OK7.8 | OK3.7 44.81,31.24 43.66,30.1 43.66,25.76 44.73,24.69 44.73,23.09 OK4.8 44.88,22.78 44.88,20.34 OK4.7 44.58,20.12 38.48,14.02 27.89,14.02 22.48,8.61 IC1.OUT | OK2.7 44.81,42.22 44.81,41.38 43.66,40.23 43.66,34.98 44.81,33.83 OK3.8
X1
  Top 0.152: SV3.2 38.56,62.26 25.15,62.26 19.96,57.07 19.05,57.07 Q1.2 20.04,57.07 21.95,55.17 21.95,53.26 D1.A
X2
  Top 0.152: SV3.4 41.15,62.26 39.93,62.26 38.41,60.73 26.06,60.73 23.24,57.91 23.24,48.39 19.89,45.03 19.05,45.03 Q2.2 19.96,45.03 21.95,43.05 21.95,41.22 D2.A
X3
  Top 0.152: SV3.6 43.66,62.26 43.66,61.04 42.14,59.51 42.14,32.38 36.88,27.13 34.59,27.13 33.83,26.36 24.16,26.36 22.02,28.5 22.02,29.18 D3.A 21.95,29.26 21.95,29.72 19.05,32.61 19.05,32.99 Q3.2
X4
  Top 0.152: D4.A 21.95,17.22 21.95,18.06 19.05,20.95 Q4.2
  Bottom 0.152: SV3.8 46.18,62.26 46.18,61.04 44.65,59.51 44.65,59.36 40.08,54.79 36.12,54.79 34.37,53.03 34.37,52.43 33.83,51.89 30.33,51.89 27.81,54.41 23.47,54.41 22.4,55.47 16.15,55.47 13.26,52.58 13.26,52.2 12.34,51.28 11.73,51.28 10.97,50.52 10.97,29.72 17.22,23.47 17.22,22.78 18.97,21.03 Q4.2
X5
  Bottom 0.152: 72.62,53.65 73,53.26 D5.A 72.62,53.65 | 72.62,53.65 72.54,53.72 69.49,53.72 66.45,56.77 57.99,56.77 55.4,59.36 55.4,59.51 54.18,60.73 51.51,60.73 49.99,62.26 48.84,62.26 SV3.10 | 72.62,53.65 75.97,57 Q5.2
X6
  Top 0.152: SV3.12 51.36,62.26 52.5,62.26 53.72,61.04 69.11,61.04 74.22,55.93 74.22,51.51 77.8,47.93 77.8,46.79 76.05,45.03 Q6.2 75.97,44.96 73.08,42.06 73.08,41.22 D6.A
X7
  Top 0.152: SV3.14 53.87,62.33 55.09,62.33 56.01,63.25 67.59,63.25 75.36,55.47 77.19,55.47 79.63,53.03 79.63,36.65 76.05,33.07 Q7.2
  Bottom 0.152: D7.A 73.08,29.26 73.08,30.1 75.97,32.99 Q7.2
X8  (via drill 0.3)
  Top 0.152: v69.88,62.26 74.07,58.06 77.11,58.06 79.93,55.24 79.93,35.43 77.8,33.3 77.8,22.78 76.05,21.03 Q8.2 75.97,20.95 73.08,18.06 73.08,17.22 D8.A
  Bottom 0.152: v69.88,62.26 56.46,62.26 SV3.16

### Text on the board
tNames: OUT | THRU | IN | IN | Pineapple I dc 1.0.0-X | DC24V
bNames: OUT | IN | THRU